# EAGLE design ATX_Power_Breakout_v1p4 (EAGLE 9.6.1)
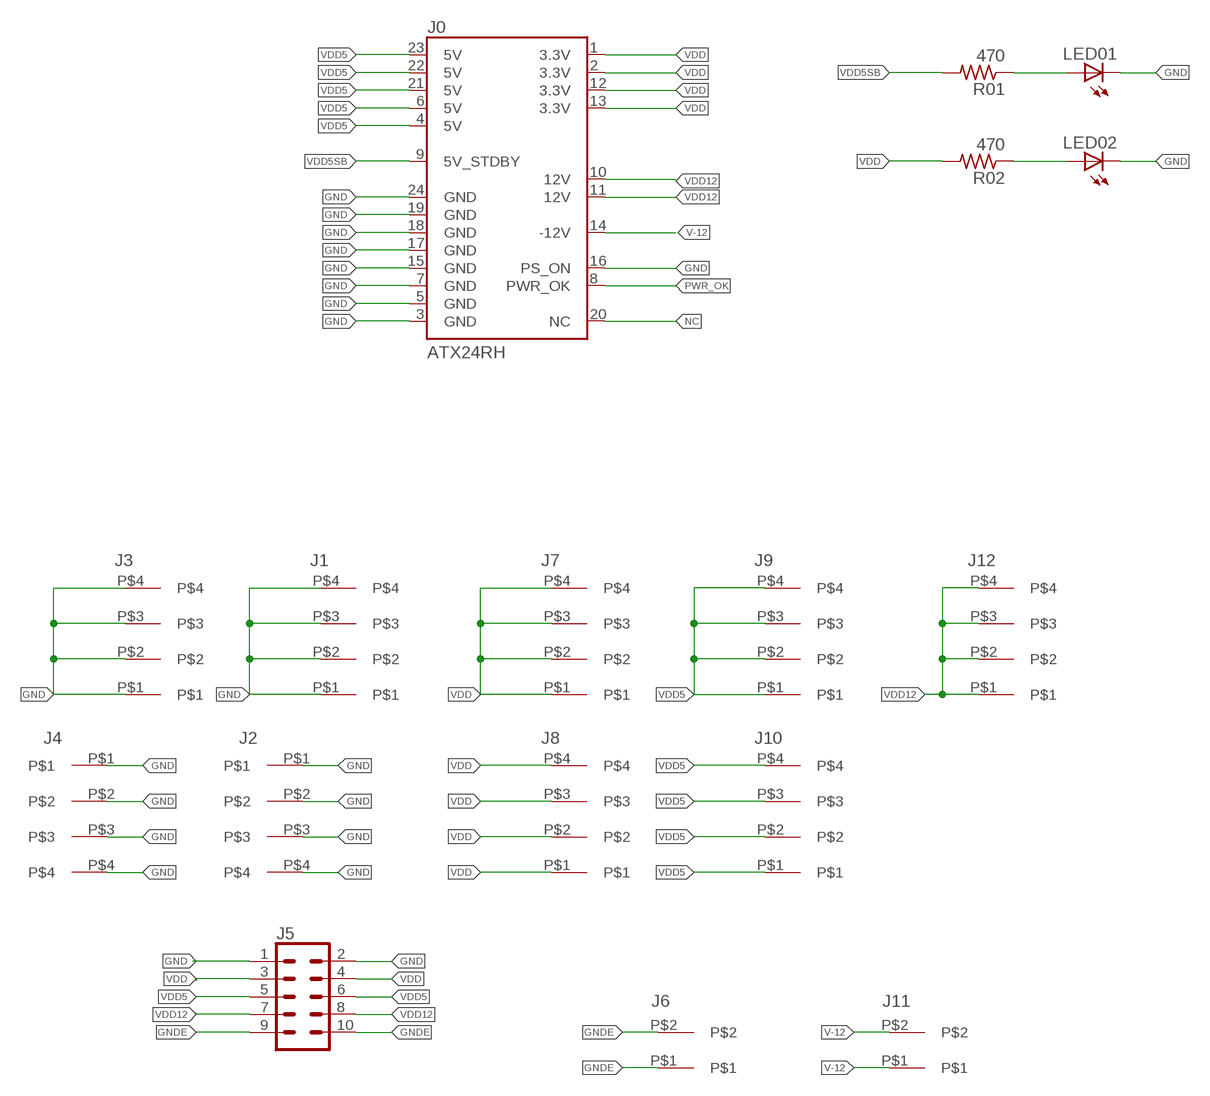
[diagram p0: schematic, sheet 1]

## Parts
J0  ATX24RH  [ATX24_RIGHT_ANGLE]
J1  3.81MM_1_X_4_RT_ANGLE_PLUG_HEADER  [1X4_3.81MM_PITCH]
J2  3.81MM_1_X_4_RT_ANGLE_PLUG_HEADER  [1X4_3.81MM_PITCH]
J3  3.81MM_1_X_4_RT_ANGLE_PLUG_HEADER  [1X4_3.81MM_PITCH]
J4  3.81MM_1_X_4_RT_ANGLE_PLUG_HEADER  [1X4_3.81MM_PITCH]
J5  CONN_05X2PTH  [2X5]
J6  3.81MM_1_X_2_RT_ANGLE_PLUG_HEADER  [2_3.81MM_PITCH]
J7  3.81MM_1_X_4_RT_ANGLE_PLUG_HEADER  [1X4_3.81MM_PITCH]
J8  3.81MM_1_X_4_RT_ANGLE_PLUG_HEADER  [1X4_3.81MM_PITCH]
J9  3.81MM_1_X_4_RT_ANGLE_PLUG_HEADER  [1X4_3.81MM_PITCH]
J10  3.81MM_1_X_4_RT_ANGLE_PLUG_HEADER  [1X4_3.81MM_PITCH]
J11  3.81MM_1_X_2_RT_ANGLE_PLUG_HEADER  [2_3.81MM_PITCH]
J12  3.81MM_1_X_4_RT_ANGLE_PLUG_HEADER  [1X4_3.81MM_PITCH]
LED01  GREEN  LED_0805_GREEN  [LED_0805_GREEN]
LED02  GREEN  LED_0805_GREEN  [LED_0805_GREEN]
R01  470  R_0402  [0402]
R02  470  R_0402  [0402]

## Nets
GND: J0.3(GND) J0.5(GND) J0.7(GND) J0.15(GND) J0.16(PS_ON) J0.17(GND) J0.18(GND) J0.19(GND) J0.24(GND) J1.P$1 J1.P$2 J1.P$3 J1.P$4 J2.P$1 J2.P$2 J2.P$3 J2.P$4 J3.P$1 J3.P$2 J3.P$3 J3.P$4 J4.P$1 J4.P$2 J4.P$3 J4.P$4 J5.1 J5.2 LED01.C LED02.C
GNDE: J5.9 J5.10 J6.P$1 J6.P$2
N$4: LED01.A R01.P$1
N$5: LED02.A R02.P$1
NC: J0.20(NC)
PWR_OK: J0.8(PWR_OK)
V-12: J0.14(-12V) J11.P$1 J11.P$2
VDD: J0.1(3.3V) J0.2(3.3V) J0.12(3.3V) J0.13(3.3V) J5.3 J5.4 J7.P$1 J7.P$2 J7.P$3 J7.P$4 J8.P$1 J8.P$2 J8.P$3 J8.P$4 R02.P$2
VDD5: J0.4(5V) J0.6(5V) J0.21(5V) J0.22(5V) J0.23(5V) J5.5 J5.6 J9.P$1 J9.P$2 J9.P$3 J9.P$4 J10.P$1 J10.P$2 J10.P$3 J10.P$4
VDD5SB: J0.9(5V_STDBY) R01.P$2
VDD12: J0.10(12V) J0.11(12V) J5.7 J5.8 J12.P$1 J12.P$2 J12.P$3 J12.P$4

## Library data of the parts
J0 = 3D_MIG_Controller:ATX24: ATX24 Pin Power Supply Connector - Right Angle PTH Mount This is a good connector for connecting a computer power supply to a PCB. It's massive, but provides many amps of power at 5V and 12V. SparkFun Products: SparkFun Benchtop Power Board Kit <https://www.sparkfun.com/products/12867> SparkFun Power Driver Shield Kit <https://www.sparkfun.com/products/10618>; PROD_ID: CONN-09674; SF_ID: PRT-09498
J1-J4 J7-J10 J12 = 3D_MIG_Controller:3.81MM_1_X_4_RT_ANGLE_PLUG_HEADER
J5 = 3D_MIG_Controller:CONN_05X2: Multi connection point. Often used as Generic Header-pin footprint for 0.1 inch spaced/style header connections For AVR SPI programming port, see special device with nice symbol: "AVR_SPI_PROG_5x2.dev" You can populate with any combo of single row headers, but if you'd like an exact match, check these: 2x5 AVR ICSP Male Header <https://www.sparkfun.com/products/778> (PRT-00778) 2x5 Pin Shrouded Header <https://www.sparkfun.com/products/8506> (PRT-08506) On any of the 0.1 inch spaced packages, you can populate with these: Break Away Headers - Straight <https://www.sparkfun.com/products/116> (PRT-00116) Break Away Male Headers - Right Angle <https://www.sparkfun.com/products/553> (PRT-00553) Female Headers <https://www.sparkfun.com/products/115> (PRT-00115) Break Away Headers - Machine Pin <https://www.sparkfun.com/products/117> (PRT-00117) Break Away Female Headers - Swiss Machine Pin <https://www.sparkfun.com/products/743> (PRT-00743) Special note: the shrouded connector mates well with our 5x2 ribbon cables: 2x5 Pin IDC Ribbon Cable <https://www.sparkfun.com/products/8535> (PRT-08535); PROD_ID: CONN-08499; SF_ID: PRT-0778
J6 J11 = 3D_MIG_Controller:3.81MM_1_X_2_RT_ANGLE_PLUG_HEADER
LED01 LED02 = 3D_MIG_Controller:LED_0805_GREEN
R01 R02 = 3D_MIG_Controller:R_0402

## Board
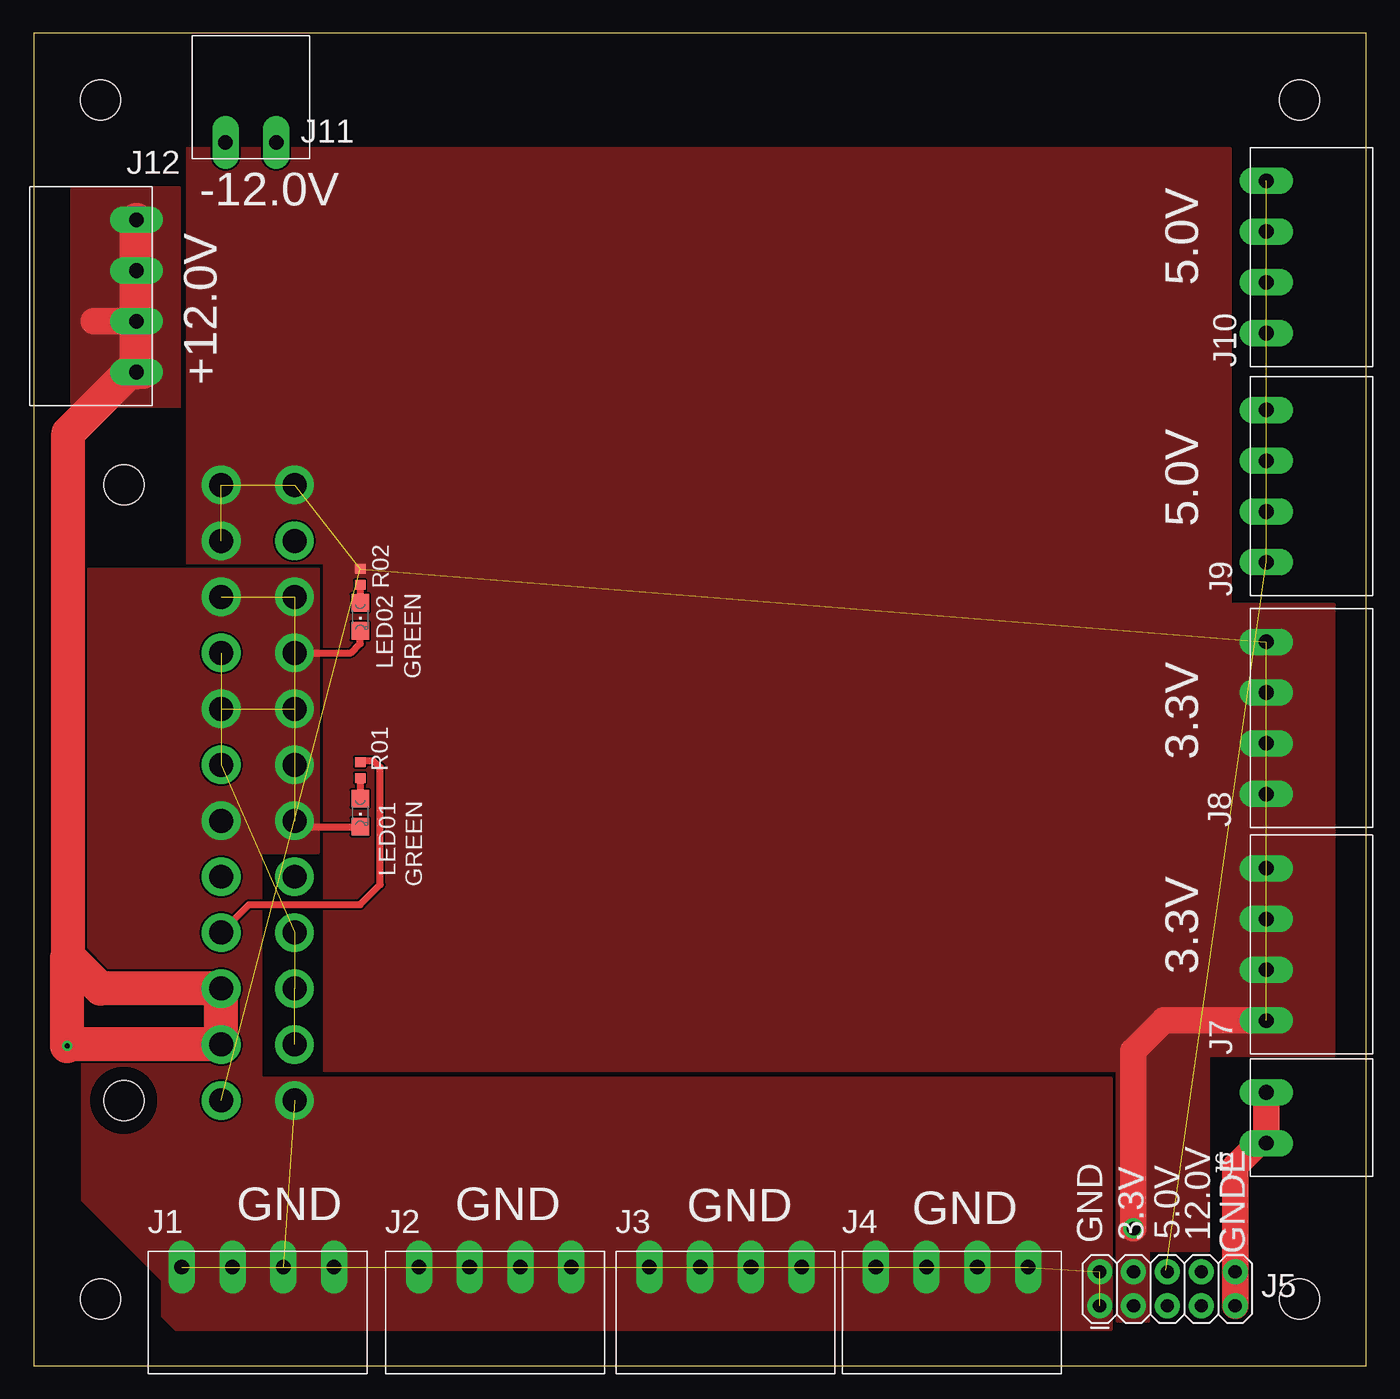
[diagram p1: board, top side]
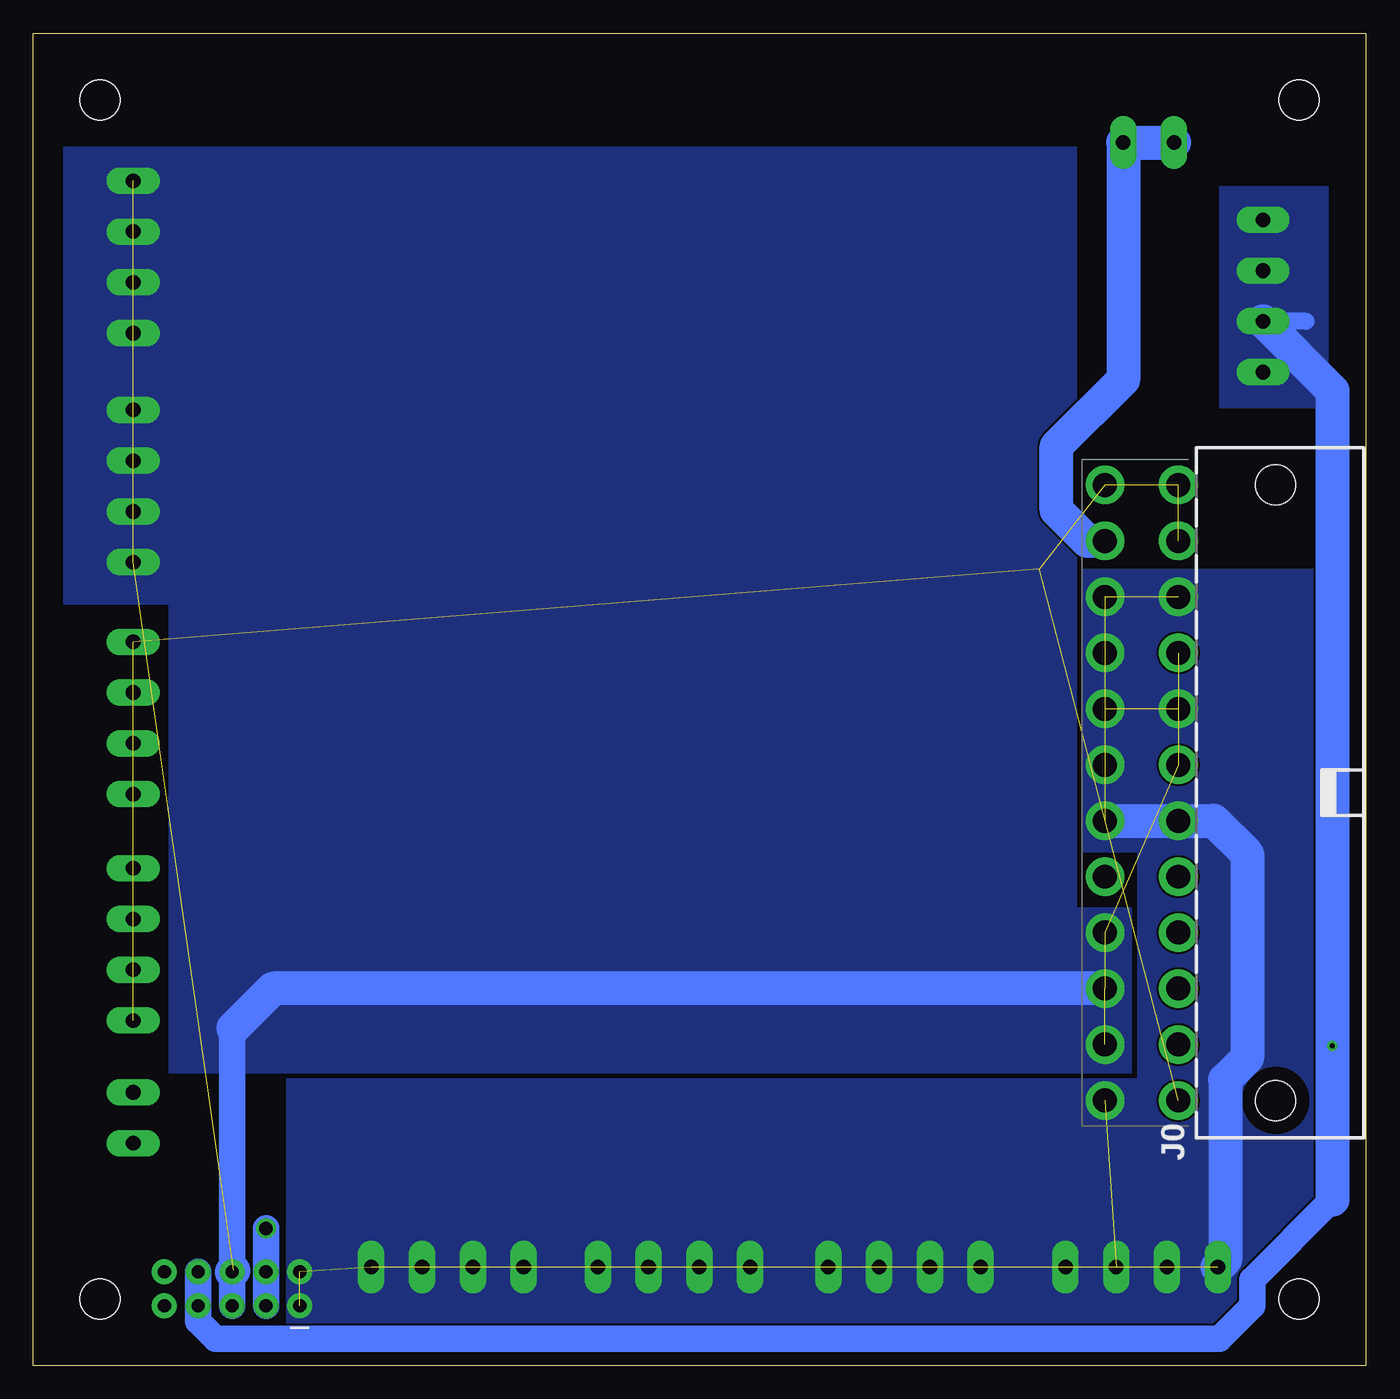
[diagram p2: board, bottom side, seen from below]

Size 100 x 100 mm. Coordinates in mm from the lower left corner, seen from the top.
Outline: 0,0 100,0 100,100 0,100 0,0
Copper layers (1*16): Top 0.035mm / dielectric 1.5mm / Bottom 0.035mm
Design rules "default": minimum track width 6mil, minimum drill 0.35mm, track to track 6mil, track to pad 6mil, pad to pad 6mil, via to via 6mil, smd to smd 6mil, copper to edge 40mil, drill to drill 6mil, minimum pad ring 10mil, minimum via ring 8mil, stop-mask expansion 4mil, vias tented up to drill 0mil, thermal gap 10mil
Holes 3 mm at 5,95 5,5 95,5 95,95

### Footprints (pad centres in the part's own frame; a part is rotated, then mirrored left to right if it is on the bottom)
ATX24_RIGHT_ANGLE = drill 1.8 pad 2.9: 1 23.1,4.76; 2 18.9,4.76; 3 14.7,4.76; 4 10.5,4.76; 5 6.3,4.76; 6 2.1,4.76; 7 -2.1,4.76; 8 -6.3,4.76; 9 -10.5,4.76; 10 -14.7,4.76; 11 -18.9,4.76; 12 -23.1,4.76; 13 23.1,10.26; 14 18.9,10.26; 15 14.7,10.26; 16 10.5,10.26; 17 6.3,10.26; 18 2.1,10.26; 19 -2.1,10.26; 20 -6.3,10.26; 21 -10.5,10.26; 22 -14.7,10.26; 23 -18.9,10.26; 24 -23.1,10.26 | hole 3: -23.1,-2.54; 23.1,-2.54
1X4_3.81MM_PITCH = drill 1.1 pad 2 long: P$1 0,0; P$2 3.81,0; P$3 7.62,0; P$4 11.43,0
2X5 = drill 1 pad 1.88: 1 0,0; 2 0,2.54; 3 2.54,0; 4 2.54,2.54; 5 5.08,0; 6 5.08,2.54; 7 7.62,0; 8 7.62,2.54; 9 10.16,0; 10 10.16,2.54
2_3.81MM_PITCH = drill 1.1 pad 2 long: P$1 0,0; P$2 3.81,0
LED_0805_GREEN = smd 1.3 x 1.3: A 0,-1.05; C 0,1.05
0402 = smd 0.8 x 0.7: P$1 0,0.6; P$2 0,-0.6

### Placement (x,y rotation side)
J0  9.3,43 90 bottom
J1  11.1,7.4 0 top
J2  28.9,7.4 0 top
J3  46.2,7.4 0 top
J4  63.2,7.4 0 top
J5  80,4.5 0 top
J6  92.5,16.7 90 top
J7  92.5,25.9 90 top
J8  92.5,42.9 90 top
J9  92.5,60.3 90 top
J10  92.5,77.5 90 top
J11  18.2,91.8 180 top
J12  7.7,86 270 top
LED01  24.5,41.5 180 top
LED02  24.5,56.2 180 top
R01  24.5,44.7 180 top
R02  24.5,59.2 180 top

### Tracks (layer width: path | path; a pad name or v marks a point on that pad's centre or on a via)
GND  (24 unrouted)
  Top 0.508: J0.19 20.01,40.45 LED01.C | J0.16 23.8,53.5 24.5,54.2 LED02.C
  Bottom 2.54: J0.19 J0.7 11.4,40.9 8.9,38.4 8.9,23.11 10.55,21.47 10.55,7.95 J1.P$1
  pour Bottom (no thermals): 21.2,59.7 21.2,38.6 17.1,38.6 17.1,21.5 81,21.5 81,2.8 14.9,2.8 10.6,2.8 9.6,3.8 9.6,6.3 9.6,6.5 3.6,12.5 3.6,59.7
  pour Top (no thermals): 21.4,59.8 3.6,59.8 3.6,12.4 9.6,6.4 9.6,3.7 10.6,2.7 80.9,2.7 80.9,21.6 17.1,21.6 17.1,38.5 21.4,38.5
GNDE
  Top 2: J5.9 J5.10 90.16,14.96 91.9,16.7 J6.P$1 J6.P$2
N$4
  Top 0.508: R01.P$1 LED01.A
N$5
  Top 0.508: R02.P$1 LED02.A
V-12
  Bottom 2.54: J0.14 20.9,61.9 23.2,64.2 23.2,69 18.2,74 J11.P$1 J11.P$2
VDD  (via drill 1)  (12 unrouted)
  Top 2: J7.P$1 84.8,25.9 82.54,23.64 v82.54,10.3
  Bottom 2: v82.54,10.3 J5.4 J5.3
  pour Top (no thermals): 97.6,57.2 97.6,23.2 88.2,23.2 88.2,8.6 83.7,8.6 83.7,3.3 81.3,3.3 81.3,22.1 21.8,22.1 21.8,60.2 11.5,60.2 11.5,91.4 89.8,91.4 89.8,57.2
VDD5  (12 unrouted)
  Bottom 2: J5.5 J5.6 85.08,25.24 84.98,25.34
  Bottom 2.54: J5.6 84.98,7.14 | 84.98,25.34 82.05,28.27 82,28.3 J0.22
  pour Bottom (no thermals): 97.7,91.4 97.7,57.2 89.8,57.2 89.8,22 17.6,22 17.6,34.3 21.7,34.3 21.7,91.4
VDD5SB
  Top 0.508: J0.9 16.16,34.6 24.5,34.6 26,36.1 26,44.9 25.5,45.4 24.6,45.4 R01.P$2
VDD12  (via drill 0.35)
  Top 2: J12.P$3 4.5,78.38
  Top 2.54: J12.P$1 J12.P$2 J12.P$3 J12.P$4 | 2.59,30.71 2.5,30.62 v2.5,24 2.6,24.1 J0.11 J0.10 5,28.3 2.59,30.71 | 2.59,30.71 2.59,70 7.19,74.6 8.2,74.6
  Bottom 1.27: J5.7 87.62,3 | 4.48,78.38 J12.P$3
  Bottom 2: 2.5,12.47 8.52,6.46 8.52,4.5 11,2.02 86.32,2.02 87.62,3.32 J5.7 J5.8
  Bottom 2.54: J12.P$3 2.5,73.18 v2.5,24 2.5,12.47
  pour Bottom (no thermals): 2.8,88.5 11,88.5 11,71.9 2.8,71.9
  pour Top (no thermals): 2.8,88.5 11,88.5 11,71.9 2.8,71.9

### Text on the board
tNames: -12.0V | +12.0V | 5.0V | 5.0V | 3.3V | 3.3V | GND | GND | GND | GND | 5.0V | GND | 3.3V | 12.0V | GNDE